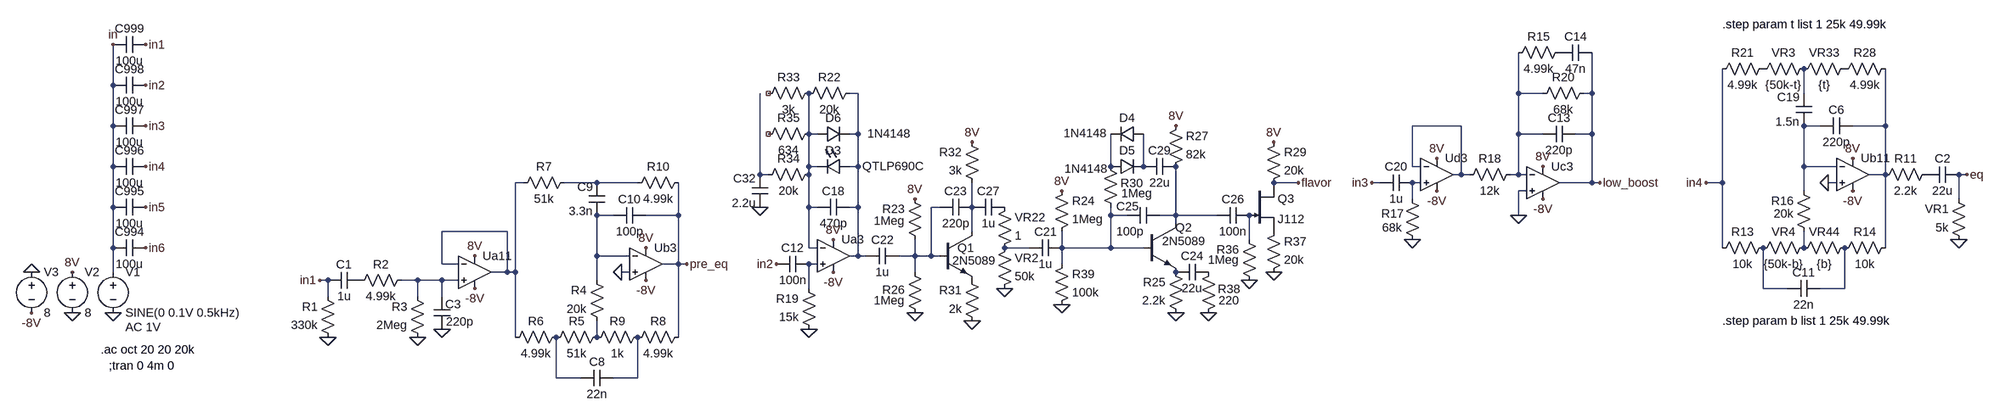
[diagram p0: schematic empress_distotion.asc]
empress_distotion.asc, the LTspice schematic file:
Version 4
SHEET 1 3148 3460
WIRE -1568 704 -1568 624
WIRE -80 720 -96 720
WIRE 1216 720 1216 640
WIRE 1264 720 1216 720
WIRE 1360 720 1360 640
WIRE 1360 720 1344 720
WIRE 1776 720 1776 672
WIRE -1568 784 -1568 704
WIRE 1104 784 1008 784
WIRE 1808 784 1776 784
WIRE 1936 784 1936 672
WIRE 1936 784 1872 784
WIRE -176 800 -176 720
WIRE -160 800 -176 800
WIRE -80 800 -80 720
WIRE -80 800 -96 800
WIRE 1216 800 1216 720
WIRE 1264 800 1216 800
WIRE 1360 800 1360 720
WIRE 1360 800 1328 800
WIRE -1568 864 -1568 784
WIRE -176 864 -176 800
WIRE -160 864 -176 864
WIRE -80 864 -80 800
WIRE -80 864 -96 864
WIRE 416 864 416 800
WIRE 480 864 480 800
WIRE 1008 864 1008 784
WIRE 1024 864 1008 864
WIRE 1776 864 1776 784
WIRE 1840 864 1776 864
WIRE -272 880 -272 720
WIRE -256 880 -272 880
WIRE -176 880 -176 864
WIRE 1104 880 1104 784
WIRE 1104 880 1088 880
WIRE 1120 880 1104 880
WIRE 1216 880 1216 800
WIRE 1216 880 1200 880
WIRE 1232 880 1216 880
WIRE 1936 880 1936 784
WIRE 1936 880 1904 880
WIRE 2096 880 2080 880
WIRE -736 896 -752 896
WIRE -592 896 -656 896
WIRE -512 896 -592 896
WIRE 784 896 736 896
WIRE 944 896 928 896
WIRE 1024 896 1008 896
WIRE 1360 896 1360 800
WIRE 1360 896 1296 896
WIRE 1376 896 1360 896
WIRE 1616 896 1616 672
WIRE 1616 896 1584 896
WIRE 1840 896 1824 896
WIRE 1232 912 1216 912
WIRE 1776 912 1776 864
WIRE 1008 928 1008 896
WIRE 2080 928 2080 880
WIRE -1568 944 -1568 864
WIRE -176 944 -176 880
WIRE -160 944 -176 944
WIRE -80 944 -80 864
WIRE -80 944 -96 944
WIRE 80 944 64 944
WIRE 144 944 144 896
WIRE -560 960 -592 960
WIRE -432 960 -432 896
WIRE -432 960 -496 960
WIRE 416 960 416 944
WIRE 448 960 416 960
WIRE 544 960 544 864
WIRE 544 960 512 960
WIRE 624 960 544 960
WIRE 1216 960 1216 912
WIRE 544 976 544 960
WIRE -768 992 -896 992
WIRE 144 992 144 944
WIRE 688 1008 688 960
WIRE -1568 1024 -1568 944
WIRE -176 1024 -176 944
WIRE -160 1024 -176 1024
WIRE 256 1024 208 1024
WIRE 320 1024 320 992
WIRE 416 1024 416 960
WIRE 416 1024 320 1024
WIRE 480 1024 416 1024
WIRE 1616 1024 1616 896
WIRE 1776 1024 1776 992
WIRE 1936 1024 1936 880
WIRE -592 1040 -592 960
WIRE -528 1040 -592 1040
WIRE -80 1040 -80 944
WIRE -80 1040 -96 1040
WIRE -64 1040 -80 1040
WIRE 32 1040 32 1008
WIRE 32 1040 0 1040
WIRE 64 1040 64 944
WIRE 64 1040 32 1040
WIRE 80 1040 64 1040
WIRE -896 1056 -896 992
WIRE -864 1056 -896 1056
WIRE -432 1056 -432 960
WIRE -432 1056 -464 1056
WIRE -416 1056 -432 1056
WIRE -160 1056 -176 1056
WIRE 320 1056 320 1024
WIRE -1568 1072 -1568 1024
WIRE -768 1072 -768 992
WIRE -768 1072 -800 1072
WIRE -752 1072 -752 896
WIRE -752 1072 -768 1072
WIRE -528 1072 -544 1072
WIRE 32 1072 32 1040
WIRE -1120 1088 -1136 1088
WIRE -944 1088 -976 1088
WIRE -896 1088 -944 1088
WIRE -864 1088 -896 1088
WIRE -592 1088 -592 1040
WIRE -176 1104 -176 1056
WIRE 1696 1104 1696 1024
WIRE 1744 1104 1696 1104
WIRE 1856 1104 1856 1024
WIRE 1856 1104 1808 1104
WIRE -1120 1120 -1120 1088
WIRE -944 1120 -944 1088
WIRE -896 1120 -896 1088
WIRE -752 1200 -752 1072
WIRE -592 1200 -592 1168
WIRE -432 1200 -432 1056
WIRE -672 1280 -672 1200
WIRE -624 1280 -672 1280
WIRE -512 1280 -512 1200
WIRE -512 1280 -560 1280
FLAG -1568 1152 0
FLAG -1568 624 in
FLAG -1648 1152 0
FLAG -1648 1072 8V
FLAG -1504 624 in1
FLAG -1504 704 in2
FLAG -1504 784 in3
FLAG -1504 864 in4
FLAG -1504 944 in5
FLAG -1504 1024 in6
FLAG -832 1040 8V
FLAG -1120 1200 0
FLAG -1136 1088 in1
FLAG -1728 1072 0
FLAG -1728 1152 -8V
FLAG -944 1200 0
FLAG -896 1184 0
FLAG -832 1104 -8V
FLAG -496 1024 8V
FLAG -496 1088 -8V
FLAG -544 1072 0
FLAG -176 1184 0
FLAG -128 1008 8V
FLAG -128 1072 -8V
FLAG -240 1056 in2
FLAG -272 944 0
FLAG 32 1152 0
FLAG 32 928 8V
FLAG 144 816 8V
FLAG 144 1168 0
FLAG 208 1104 0
FLAG 320 1136 0
FLAG 320 912 8V
FLAG 544 784 8V
FLAG 544 1152 0
FLAG 608 1152 0
FLAG 688 1088 0
FLAG 736 1072 0
FLAG 736 816 8V
FLAG 1008 1008 0
FLAG 1056 848 8V
FLAG 1056 912 -8V
FLAG 1264 864 8V
FLAG 1264 928 -8V
FLAG 1216 960 0
FLAG 1872 848 8V
FLAG 1872 912 -8V
FLAG 1824 896 0
FLAG 2080 1008 0
FLAG 1584 896 in4
FLAG 928 896 in3
FLAG -416 1056 pre_eq
FLAG 784 896 flavor
FLAG 1376 896 low_boost
FLAG 2096 880 eq
SYMBOL voltage -1568 1056 R0
WINDOW 123 24 124 Left 2
WINDOW 39 0 0 Left 2
SYMATTR Value2 AC 1V
SYMATTR InstName V1
SYMATTR Value SINE(0 0.1V 0.5kHz)
SYMBOL voltage -1648 1056 R0
WINDOW 123 0 0 Left 0
WINDOW 39 0 0 Left 0
SYMATTR InstName V2
SYMATTR Value 8
SYMBOL Opamps\\UniversalOpamp2 -832 1072 R0
SYMATTR InstName Ua11
SYMBOL cap -1504 688 R90
WINDOW 0 0 32 VBottom 2
WINDOW 3 32 32 VTop 2
SYMATTR InstName C998
SYMATTR Value 100u
SYMBOL cap -1504 768 R90
WINDOW 0 0 32 VBottom 2
WINDOW 3 32 32 VTop 2
SYMATTR InstName C997
SYMATTR Value 100u
SYMBOL cap -1504 848 R90
WINDOW 0 0 32 VBottom 2
WINDOW 3 32 32 VTop 2
SYMATTR InstName C996
SYMATTR Value 100u
SYMBOL cap -1504 608 R90
WINDOW 0 0 32 VBottom 2
WINDOW 3 32 32 VTop 2
SYMATTR InstName C999
SYMATTR Value 100u
SYMBOL cap -1504 928 R90
WINDOW 0 0 32 VBottom 2
WINDOW 3 32 32 VTop 2
SYMATTR InstName C995
SYMATTR Value 100u
SYMBOL cap -1504 1008 R90
WINDOW 0 0 32 VBottom 2
WINDOW 3 32 32 VTop 2
SYMATTR InstName C994
SYMATTR Value 100u
SYMBOL cap -1056 1072 R90
WINDOW 0 0 32 VBottom 2
WINDOW 3 32 32 VTop 2
SYMATTR InstName C1
SYMATTR Value 1u
SYMBOL res -928 1216 R180
WINDOW 0 36 76 Left 2
WINDOW 3 36 40 Left 2
SYMATTR InstName R3
SYMATTR Value 2Meg
SYMBOL res -1104 1216 R180
WINDOW 0 36 76 Left 2
WINDOW 3 36 40 Left 2
SYMATTR InstName R1
SYMATTR Value 330k
SYMBOL res -960 1072 R90
WINDOW 0 0 56 VBottom 2
WINDOW 3 32 56 VTop 2
SYMATTR InstName R2
SYMATTR Value 4.99k
SYMBOL voltage -1728 1056 R0
WINDOW 123 0 0 Left 0
WINDOW 39 0 0 Left 0
SYMATTR InstName V3
SYMATTR Value 8
SYMBOL cap -880 1184 R180
WINDOW 0 -21 49 Left 2
WINDOW 3 -46 15 Left 2
SYMATTR InstName C3
SYMATTR Value 220p
SYMBOL res -656 1184 R90
WINDOW 0 0 56 VBottom 2
WINDOW 3 32 56 VTop 2
SYMATTR InstName R6
SYMATTR Value 4.99k
SYMBOL res -576 1184 R90
WINDOW 0 0 56 VBottom 2
WINDOW 3 32 56 VTop 2
SYMATTR InstName R5
SYMATTR Value 51k
SYMBOL res -496 1184 R90
WINDOW 0 0 56 VBottom 2
WINDOW 3 32 56 VTop 2
SYMATTR InstName R9
SYMATTR Value 1k
SYMBOL res -416 1184 R90
WINDOW 0 0 56 VBottom 2
WINDOW 3 32 56 VTop 2
SYMATTR InstName R8
SYMATTR Value 4.99k
SYMBOL res -576 1184 R180
WINDOW 0 36 76 Left 2
WINDOW 3 36 40 Left 2
SYMATTR InstName R4
SYMATTR Value 20k
SYMBOL Opamps\\UniversalOpamp2 -496 1056 R0
SYMATTR InstName Ub3
SYMBOL cap -560 1264 R90
WINDOW 0 0 32 VBottom 2
WINDOW 3 32 32 VTop 2
SYMATTR InstName C8
SYMATTR Value 22n
SYMBOL cap -496 944 R90
WINDOW 0 0 32 VBottom 2
WINDOW 3 32 32 VTop 2
SYMATTR InstName C10
SYMATTR Value 100p
SYMBOL cap -576 960 R180
WINDOW 0 24 56 Left 2
WINDOW 3 24 8 Left 2
SYMATTR InstName C9
SYMATTR Value 3.3n
SYMBOL res -640 880 R90
WINDOW 0 0 56 VBottom 2
WINDOW 3 32 56 VTop 2
SYMATTR InstName R7
SYMATTR Value 51k
SYMBOL res -416 880 R90
WINDOW 0 0 56 VBottom 2
WINDOW 3 32 56 VTop 2
SYMATTR InstName R10
SYMATTR Value 4.99k
SYMBOL cap -176 1040 R90
WINDOW 0 0 32 VBottom 2
WINDOW 3 32 32 VTop 2
SYMATTR InstName C12
SYMATTR Value 100n
SYMBOL res -160 1200 R180
WINDOW 0 36 76 Left 2
WINDOW 3 36 40 Left 2
SYMATTR InstName R19
SYMATTR Value 15k
SYMBOL Opamps\\UniversalOpamp2 -128 1040 R0
SYMATTR InstName Ua3
SYMBOL cap -96 928 R90
WINDOW 0 0 32 VBottom 2
WINDOW 3 32 32 VTop 2
SYMATTR InstName C18
SYMATTR Value 470p
SYMBOL diode -160 784 M90
WINDOW 0 0 32 VBottom 2
WINDOW 3 0 141 VTop 2
SYMATTR InstName D6
SYMATTR Value 1N4148
SYMBOL LED -96 848 R90
WINDOW 0 0 32 VBottom 2
WINDOW 3 0 -85 VTop 2
SYMATTR InstName D3
SYMATTR Value QTLP690C
SYMBOL res -80 704 R90
WINDOW 0 0 56 VBottom 2
WINDOW 3 32 56 VTop 2
SYMATTR InstName R22
SYMATTR Value 20k
SYMBOL res -160 704 R90
WINDOW 0 0 56 VBottom 2
WINDOW 3 32 56 VTop 2
SYMATTR InstName R33
SYMATTR Value 3k
SYMBOL res -160 784 R90
WINDOW 0 0 56 VBottom 2
WINDOW 3 32 56 VTop 2
SYMATTR InstName R35
SYMATTR Value 634
SYMBOL res -160 864 R90
WINDOW 0 0 56 VBottom 2
WINDOW 3 32 56 VTop 2
SYMATTR InstName R34
SYMATTR Value 20k
SYMBOL cap -256 880 M0
SYMATTR InstName C32
SYMATTR Value 2.2u
SYMBOL cap 0 1024 R90
WINDOW 0 0 32 VBottom 2
WINDOW 3 32 32 VTop 2
SYMATTR InstName C22
SYMATTR Value 1u
SYMBOL res 48 1024 R180
WINDOW 0 36 76 Left 2
WINDOW 3 36 53 Left 2
SYMATTR InstName R23
SYMATTR Value 1Meg
SYMBOL res 48 1168 R180
WINDOW 0 36 61 Left 2
WINDOW 3 36 40 Left 2
SYMATTR InstName R26
SYMATTR Value 1Meg
SYMBOL npn 80 992 R0
WINDOW 0 35 32 Left 2
WINDOW 3 25 57 Left 2
SYMATTR InstName Q1
SYMATTR Value 2N5089
SYMBOL cap 144 928 R90
WINDOW 0 0 32 VBottom 2
WINDOW 3 32 32 VTop 2
SYMATTR InstName C23
SYMATTR Value 220p
SYMBOL res 160 1184 R180
WINDOW 0 36 76 Left 2
WINDOW 3 36 40 Left 2
SYMATTR InstName R31
SYMATTR Value 2k
SYMBOL res 160 912 R180
WINDOW 0 36 76 Left 2
WINDOW 3 36 40 Left 2
SYMATTR InstName R32
SYMATTR Value 3k
SYMBOL cap 208 928 R90
WINDOW 0 0 32 VBottom 2
WINDOW 3 32 32 VTop 2
SYMATTR InstName C27
SYMATTR Value 1u
SYMBOL res 192 1040 M180
WINDOW 0 36 76 Left 2
WINDOW 3 36 40 Left 2
SYMATTR InstName VR22
SYMATTR Value 1
SYMBOL res 192 1120 M180
WINDOW 0 36 76 Left 2
WINDOW 3 36 40 Left 2
SYMATTR InstName VR2
SYMATTR Value 50k
SYMBOL res 304 1008 M180
WINDOW 0 36 76 Left 2
WINDOW 3 36 40 Left 2
SYMATTR InstName R24
SYMATTR Value 1Meg
SYMBOL res 304 1152 M180
WINDOW 0 36 76 Left 2
WINDOW 3 36 40 Left 2
SYMATTR InstName R39
SYMATTR Value 100k
SYMBOL cap 320 1008 R90
WINDOW 0 0 32 VBottom 2
WINDOW 3 32 32 VTop 2
SYMATTR InstName C21
SYMATTR Value 1u
SYMBOL npn 480 976 R0
WINDOW 0 63 8 Left 2
WINDOW 3 37 35 Left 2
SYMATTR InstName Q2
SYMATTR Value 2N5089
SYMBOL cap 512 944 R90
WINDOW 0 14 63 VBottom 2
WINDOW 3 32 58 VTop 2
SYMATTR InstName C25
SYMATTR Value 100p
SYMBOL diode 480 784 R90
WINDOW 0 0 32 VBottom 2
WINDOW 3 -1 114 VTop 2
SYMATTR InstName D4
SYMATTR Value 1N4148
SYMBOL diode 416 848 M90
WINDOW 0 0 32 VBottom 2
WINDOW 3 5 -48 VTop 2
SYMATTR InstName D5
SYMATTR Value 1N4148
SYMBOL res 528 880 M180
WINDOW 0 36 76 Left 2
WINDOW 3 36 40 Left 2
SYMATTR InstName R27
SYMATTR Value 82k
SYMBOL res 560 1168 R180
WINDOW 0 36 76 Left 2
WINDOW 3 36 40 Left 2
SYMATTR InstName R25
SYMATTR Value 2.2k
SYMBOL cap 544 1088 R270
WINDOW 0 32 32 VTop 2
WINDOW 3 0 32 VBottom 2
SYMATTR InstName C24
SYMATTR Value 22u
SYMBOL res 592 1168 M180
WINDOW 0 34 63 Left 2
WINDOW 3 36 40 Left 2
SYMATTR InstName R38
SYMATTR Value 220
SYMBOL cap 544 848 R90
WINDOW 0 0 32 VBottom 2
WINDOW 3 32 32 VTop 2
SYMATTR InstName C29
SYMATTR Value 22u
SYMBOL res 432 960 R180
WINDOW 0 -48 63 Left 2
WINDOW 3 -66 43 Left 2
SYMATTR InstName R30
SYMATTR Value 1Meg
SYMBOL njf 688 896 R0
SYMATTR InstName Q3
SYMATTR Value J112
SYMBOL cap 688 944 R90
WINDOW 0 0 32 VBottom 2
WINDOW 3 32 32 VTop 2
SYMATTR InstName C26
SYMATTR Value 100n
SYMBOL res 704 1104 R180
WINDOW 0 36 76 Left 2
WINDOW 3 36 56 Left 2
SYMATTR InstName R36
SYMATTR Value 1Meg
SYMBOL res 720 1088 M180
WINDOW 0 36 76 Left 2
WINDOW 3 36 40 Left 2
SYMATTR InstName R37
SYMATTR Value 20k
SYMBOL res 720 912 M180
WINDOW 0 36 76 Left 2
WINDOW 3 36 40 Left 2
SYMATTR InstName R29
SYMATTR Value 20k
SYMBOL cap 1008 880 R90
WINDOW 0 0 32 VBottom 2
WINDOW 3 32 32 VTop 2
SYMATTR InstName C20
SYMATTR Value 1u
SYMBOL res 1024 1024 R180
WINDOW 0 33 67 Left 2
WINDOW 3 36 40 Left 2
SYMATTR InstName R17
SYMATTR Value 68k
SYMBOL Opamps\\UniversalOpamp2 1056 880 R0
SYMATTR InstName Ud3
SYMBOL res 1216 864 R90
WINDOW 0 0 56 VBottom 2
WINDOW 3 32 56 VTop 2
SYMATTR InstName R18
SYMATTR Value 12k
SYMBOL Opamps\\UniversalOpamp2 1264 896 R0
SYMATTR InstName Uc3
SYMBOL cap 1328 784 R90
WINDOW 0 0 32 VBottom 2
WINDOW 3 32 32 VTop 2
SYMATTR InstName C13
SYMATTR Value 220p
SYMBOL res 1360 704 R90
WINDOW 0 0 56 VBottom 2
WINDOW 3 32 56 VTop 2
SYMATTR InstName R20
SYMATTR Value 68k
SYMBOL res 1312 624 R90
WINDOW 0 0 56 VBottom 2
WINDOW 3 32 56 VTop 2
SYMATTR InstName R15
SYMATTR Value 4.99k
SYMBOL cap 1360 624 R90
WINDOW 0 0 32 VBottom 2
WINDOW 3 32 32 VTop 2
SYMATTR InstName C14
SYMATTR Value 47n
SYMBOL res 1712 1008 R90
WINDOW 0 0 56 VBottom 2
WINDOW 3 32 56 VTop 2
SYMATTR InstName R13
SYMATTR Value 10k
SYMBOL res 1792 1008 R90
WINDOW 0 0 56 VBottom 2
WINDOW 3 32 56 VTop 2
SYMATTR InstName VR4
SYMATTR Value {50k-b}
SYMBOL res 1872 1008 R90
WINDOW 0 0 56 VBottom 2
WINDOW 3 32 56 VTop 2
SYMATTR InstName VR44
SYMATTR Value {b}
SYMBOL res 1952 1008 R90
WINDOW 0 0 56 VBottom 2
WINDOW 3 32 56 VTop 2
SYMATTR InstName R14
SYMATTR Value 10k
SYMBOL res 1792 1008 R180
WINDOW 0 36 76 Left 2
WINDOW 3 36 51 Left 2
SYMATTR InstName R16
SYMATTR Value 20k
SYMBOL Opamps\\UniversalOpamp2 1872 880 R0
SYMATTR InstName Ub11
SYMBOL cap 1808 1088 R90
WINDOW 0 0 32 VBottom 2
WINDOW 3 32 32 VTop 2
SYMATTR InstName C11
SYMATTR Value 22n
SYMBOL cap 1872 768 R90
WINDOW 0 0 32 VBottom 2
WINDOW 3 32 32 VTop 2
SYMATTR InstName C6
SYMATTR Value 220p
SYMBOL cap 1792 784 R180
WINDOW 0 24 56 Left 2
WINDOW 3 24 8 Left 2
SYMATTR InstName C19
SYMATTR Value 1.5n
SYMBOL res 1952 656 R90
WINDOW 0 0 56 VBottom 2
WINDOW 3 32 56 VTop 2
SYMATTR InstName R28
SYMATTR Value 4.99k
SYMBOL res 1712 656 R90
WINDOW 0 0 56 VBottom 2
WINDOW 3 32 56 VTop 2
SYMATTR InstName R21
SYMATTR Value 4.99k
SYMBOL res 1792 656 R90
WINDOW 0 0 56 VBottom 2
WINDOW 3 32 56 VTop 2
SYMATTR InstName VR3
SYMATTR Value {50k-t}
SYMBOL res 1872 656 R90
WINDOW 0 0 56 VBottom 2
WINDOW 3 32 56 VTop 2
SYMATTR InstName VR33
SYMATTR Value {t}
SYMBOL res 2032 864 R90
WINDOW 0 0 56 VBottom 2
WINDOW 3 32 56 VTop 2
SYMATTR InstName R11
SYMATTR Value 2.2k
SYMBOL cap 2080 864 R90
WINDOW 0 0 32 VBottom 2
WINDOW 3 32 32 VTop 2
SYMATTR InstName C2
SYMATTR Value 22u
SYMBOL res 2096 1024 R180
WINDOW 0 36 76 Left 2
WINDOW 3 36 40 Left 2
SYMATTR InstName VR1
SYMATTR Value 5k
TEXT -1592 1224 Left 2 !.ac oct 20 20 20k
TEXT -1576 1256 Left 2 !;tran 0 4m 0
TEXT 1616 584 Left 2 !.step param t list 1 25k 49.99k
TEXT 1616 1168 Left 2 !.step param b list 1 25k 49.99k

The netlist it stands for:
* empress_distotion.asc
V1 in 0 SINE(0 0.1V 0.5kHz) AC 1V
V2 8V 0 8
XUa11 N023 N011 8V -8V N011 level.2 Avol=1Meg GBW=10Meg Slew=10Meg ilimit=25m rail=0 Vos=0 phimargin=45 en=0 enk=0 in=0 ink=0 Rin=500Meg  ; pins IN+ IN- V+ V- OUT
C998 in2 in 100u
C997 in3 in 100u
C996 in4 in 100u
C999 in1 in 100u
C995 in5 in 100u
C994 in6 in 100u
C1 P001 in1 1u
R3 0 N023 2Meg
R1 0 in1 330k
R2 N023 P001 4.99k
V3 0 -8V 8
C3 0 N023 220p
R6 N027 N011 4.99k
R5 N026 N027 51k
R9 N028 N026 1k
R8 pre_eq N028 4.99k
R4 N026 N016 20k
XUb3 0 N016 8V -8V pre_eq level.2 Avol=1Meg GBW=10Meg Slew=10Meg ilimit=25m rail=0 Vos=0 phimargin=45 en=0 enk=0 in=0 ink=0 Rin=500Meg  ; pins IN+ IN- V+ V- OUT
C8 N028 N027 22n
C10 pre_eq N016 100p
C9 N016 N012 3.3n
R7 N012 N011 51k
R10 pre_eq N012 4.99k
C12 N022 in2 100n
R19 0 N022 15k
XUa3 N022 N007 8V -8V N001 level.2 Avol=1Meg GBW=10Meg Slew=10Meg ilimit=25m rail=0 Vos=0 phimargin=45 en=0 enk=0 in=0 ink=0 Rin=500Meg  ; pins IN+ IN- V+ V- OUT
C18 N001 N007 470p
D6 N007 N001 1N4148
D3 N001 N007 QTLP690C
R22 N001 N007 20k
R33 N007 NC_01 3k
R35 N007 NC_02 634
R34 N007 N010 20k
C32 N010 0 2.2u
C22 N014 N001 1u
R23 N014 8V 1Meg
R26 0 N014 1Meg
Q1 N015 N014 P002 0 2N5089
C23 N015 N014 220p
R31 0 P002 2k
R32 N015 8V 3k
C27 P003 N015 1u
R§VR22 N020 P003 1
R§VR2 0 N020 50k
R24 N017 8V 1Meg
R39 0 N017 100k
C21 N017 N020 1u
Q2 N018 N017 P004 0 2N5089
C25 N018 N017 100p
D4 N009 N008 1N4148
D5 N008 N009 1N4148
R27 N018 8V 82k
R25 0 P004 2.2k
C24 P004 P005 22u
R38 0 P005 220
C29 N018 N009 22u
R30 N017 N008 1Meg
J§Q3 flavor N019 P006 J112
C26 N019 N018 100n
R36 0 N019 1Meg
R37 0 P006 20k
R29 flavor 8V 20k
C20 N013 in3 1u
R17 0 N013 68k
XUd3 N013 N004 8V -8V N004 level.2 Avol=1Meg GBW=10Meg Slew=10Meg ilimit=25m rail=0 Vos=0 phimargin=45 en=0 enk=0 in=0 ink=0 Rin=500Meg  ; pins IN+ IN- V+ V- OUT
R18 N002 N004 12k
XUc3 0 N002 8V -8V low_boost level.2 Avol=1Meg GBW=10Meg Slew=10Meg ilimit=25m rail=0 Vos=0 phimargin=45 en=0 enk=0 in=0 ink=0 Rin=500Meg  ; pins IN+ IN- V+ V- OUT
C13 low_boost N002 220p
R20 low_boost N002 68k
R15 P007 N002 4.99k
C14 low_boost P007 47n
R13 N024 in4 10k
R§VR4 N021 N024 {50k-b}
R§VR44 N025 N021 {b}
R14 N006 N025 10k
R16 N021 N005 20k
XUb11 0 N005 8V -8V N006 level.2 Avol=1Meg GBW=10Meg Slew=10Meg ilimit=25m rail=0 Vos=0 phimargin=45 en=0 enk=0 in=0 ink=0 Rin=500Meg  ; pins IN+ IN- V+ V- OUT
C11 N025 N024 22n
C6 N006 N005 220p
C19 N005 N003 1.5n
R28 N006 P008 4.99k
R21 P009 in4 4.99k
R§VR3 N003 P009 {50k-t}
R§VR33 P008 N003 {t}
R11 P010 N006 2.2k
C2 eq P010 22u
R§VR1 0 eq 5k
.model D D
.lib standard.dio
.model NPN NPN
.model PNP PNP
.lib standard.bjt
.model NJF NJF
.model PJF PJF
.lib standard.jft
.ac oct 20 20 20k
;tran 0 4m 0
.step param t list 1 25k 49.99k
.step param b list 1 25k 49.99k
.lib UniversalOpamps2.sub
.backanno
.end